# Altium project LF_v5_SensorBoard.PrjPcb
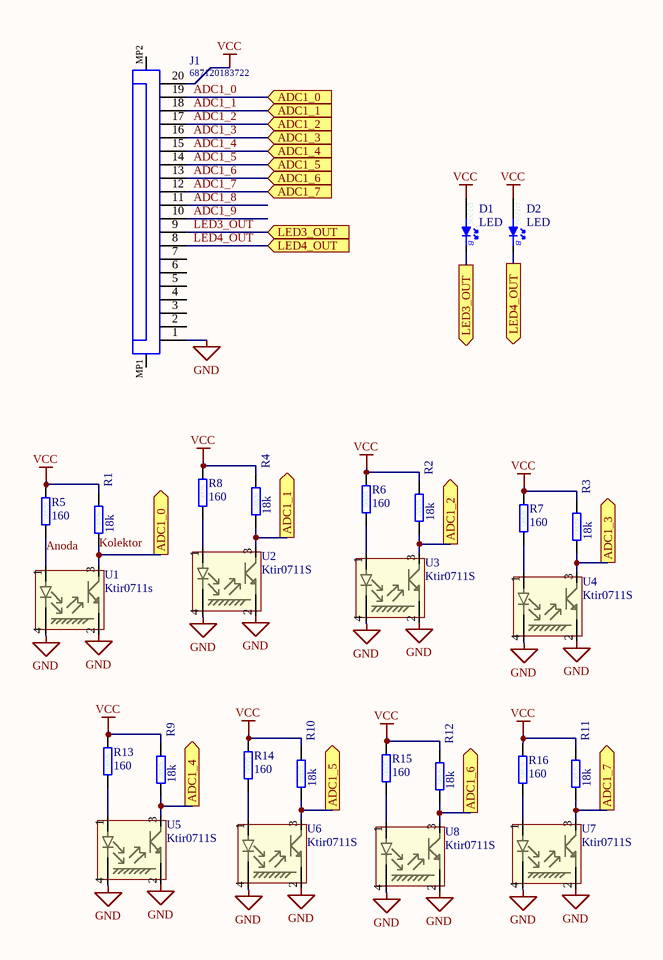
[diagram p0: LF_v5_SensorBoard.SchDoc]
1 sheet, 27 parts. Net scope: flat (ports and power ports of the same name join across sheets).
Board file: LF_v5_SensorBoard.PcbDoc

## Sheet LF_v5_SensorBoard.SchDoc: Hi
size A4 portrait; Autor: Teodor; Dopisek: Cel:; Cel: Ehh; Projektant: Teodor

### Parts
D1  LED  [D1206_2]
D2  LED  [D1206_2]
J1  687120183722  [687120183722]
R1  18k  [0805R]
R2  18k  [0805R]
R3  18k  [0805R]
R4  18k  [0805R]
R5  160  [0805R]
R6  160  [0805R]
R7  160  [0805R]
R8  160  [0805R]
R9  18k  [0805R]
R10  18k  [0805R]
R11  18k  [0805R]
R12  18k  [0805R]
R13  160  [0805R]
R14  160  [0805R]
R15  160  [0805R]
R16  160  [0805R]
U1  Ktir0711s  [KTIR0711S_fp]
U2  Ktir0711S  [KTIR0711S_fp]
U3  Ktir0711S  [KTIR0711S_fp]
U4  Ktir0711S  [KTIR0711S_fp]
U5  Ktir0711S  [KTIR0711S_fp]
U6  Ktir0711S  [KTIR0711S_fp]
U7  Ktir0711S  [KTIR0711S_fp]
U8  Ktir0711S  [KTIR0711S_fp]

### Ports
ADC1_0 (in), ADC1_0 (out), ADC1_1 (in), ADC1_1 (out), ADC1_2 (in), ADC1_2 (out), ADC1_3 (in), ADC1_3 (out), ADC1_4 (in), ADC1_4 (out), ADC1_5 (in), ADC1_5 (out), ADC1_6 (in), ADC1_6 (out), ADC1_7 (in), ADC1_7 (out), LED3_OUT (in), LED3_OUT (out), LED4_OUT (in), LED4_OUT (out)

### Nets
GND: J1.1 U1.2 U1.4 U2.2 U2.4 U3.2 U3.4 U4.2 U4.4 U5.2 U5.4 U6.2 U6.4 U7.2 U7.4 U8.2 U8.4
VCC: D1.2(A) D2.2(A) J1.20 R1.1 R2.1 R3.1 R4.1 R5.1 R6.1 R7.1 R8.1 R9.1 R10.1 R11.1 R12.1 R13.1 R14.1 R15.1 R16.1
ADC1_0: J1.19 R1.2 U1.3 ; port ADC1_0  [also labelled Kolektor]
ADC1_1: J1.18 R4.2 U2.3 ; port ADC1_1
ADC1_2: J1.17 R2.2 U3.3 ; port ADC1_2
ADC1_3: J1.16 R3.2 U4.3 ; port ADC1_3
ADC1_4: J1.15 R9.2 U5.3 ; port ADC1_4
ADC1_5: J1.14 R10.2 U6.3 ; port ADC1_5
ADC1_6: J1.13 R12.2 U8.3 ; port ADC1_6
ADC1_7: J1.12 R11.2 U7.3 ; port ADC1_7
ADC1_8: J1.11
ADC1_9: J1.10
Anoda: R5.2 U1.1
LED3_OUT: D1.1(K) J1.9 ; port LED3_OUT
LED4_OUT: D2.1(K) J1.8 ; port LED4_OUT
NetR6_2: R6.2 U3.1
NetR7_2: R7.2 U4.1
NetR8_2: R8.2 U2.1
NetR13_2: R13.2 U5.1
NetR14_2: R14.2 U6.1
NetR15_2: R15.2 U8.1
NetR16_2: R16.2 U7.1

Not connected (* = marked no-connect by the designer): J1 2 3 4 5 6 7 MP1 MP2

### Notes on the sheet
- Tytuł:
- Rozmiar:
- Data:
- A4
- Designed by:
- Czas:
- Część
- z
- (in symbol 1k-1%  0805) 0805
- (in symbol 160k-1%  0805) 0805
- (in symbol LL-S150BC-B4-1B  D1206) D1206; B

### Library data of the parts
D1 D2 = LL-S150BC-B4-1B  D1206: Dioda LED Niebieska  120°   20mA   14-22 mCd; Index: 24360; Nazwa: LL-S150BC-B4-1B
J1 = CMP-1502-01579-1: SMT ZIF Connectors Low Profile WR-FPC, Horizontal, Bottom Contact, pitch 0.5 mm, 20 pins; Manufacturer: Wurth Elektronik; Rated Current: 0.4A; Pin Number: 20; Withstanding Voltage: 250VAC; Contact Resistance: 30mOhm; Working Voltage: 50VAC; Pitch: 0.5mm; Package Reference: 687120183722; Publisher: WurthElektronik; Packaging: TapeandReel; Part Number: 687120183722; Operating Temperature: -25to85degC; Orientation: Horizontal; Datasheet URL: https://katalog.we-online.de/em/datasheet/687120183722.pdf; Contact Design: BottomContact; Manufacturer URL: http://www.we-online.de; Mounting Technology: SMT
R1-R4 R9-R12 = 160k-1%  0805: Rezystor 0,125W; Nazwa: 160k-1%
R5-R8 R13-R16 = 1k-1%  0805: Rezystor 0,125W; Nazwa: 1k-1%
U1-U8 = Component_1